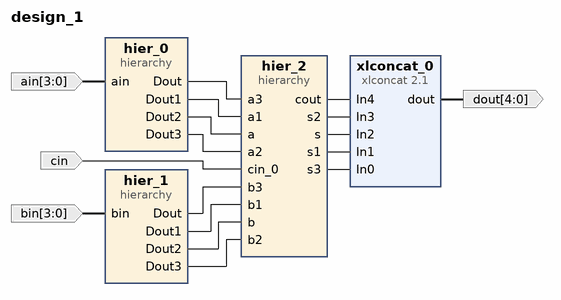
[diagram p0: block diagram of the top level]
# Vivado block design design_1, xc7a100tcsg324-1, Vivado 2024.2
create_bd_design design_1

create_bd_port -dir I -from 3 -to 0 ain
create_bd_port -dir I -from 3 -to 0 bin
create_bd_port -dir I cin
create_bd_port -dir O -from 4 -to 0 dout

create_bd_cell -type hier hier_0
create_bd_cell -type hier hier_1
create_bd_cell -type ip -vlnv xilinx.com:ip:xlconcat:2.1 xlconcat_0
set_property -dict {CONFIG.NUM_PORTS 5} [get_bd_cells xlconcat_0]
create_bd_cell -type hier hier_2

# ---- hierarchy /hier_0 ----
current_bd_instance /hier_0
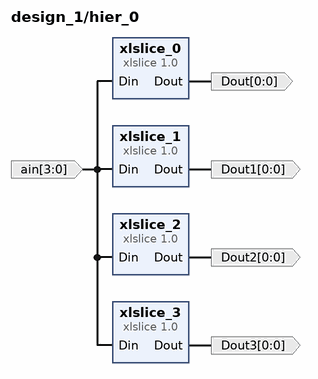
[diagram p1: block diagram inside /hier_0]
create_bd_pin -dir I -from 3 -to 0 ain
create_bd_pin -dir O -from 0 -to 0 Dout
create_bd_pin -dir O -from 0 -to 0 Dout1
create_bd_pin -dir O -from 0 -to 0 Dout2
create_bd_pin -dir O -from 0 -to 0 Dout3

create_bd_cell -type ip -vlnv xilinx.com:ip:xlslice:1.0 xlslice_0
set_property -dict {CONFIG.DIN_FROM 0 CONFIG.DIN_TO 0 CONFIG.DIN_WIDTH 4} [get_bd_cells xlslice_0]
create_bd_cell -type ip -vlnv xilinx.com:ip:xlslice:1.0 xlslice_1
set_property -dict {CONFIG.DIN_FROM 1 CONFIG.DIN_TO 1 CONFIG.DIN_WIDTH 4} [get_bd_cells xlslice_1]
create_bd_cell -type ip -vlnv xilinx.com:ip:xlslice:1.0 xlslice_2
set_property -dict {CONFIG.DIN_FROM 2 CONFIG.DIN_TO 2 CONFIG.DIN_WIDTH 4} [get_bd_cells xlslice_2]
create_bd_cell -type ip -vlnv xilinx.com:ip:xlslice:1.0 xlslice_3
set_property -dict {CONFIG.DIN_FROM 3 CONFIG.DIN_TO 3 CONFIG.DIN_WIDTH 4} [get_bd_cells xlslice_3]

# ---- hierarchy /hier_1 ----
current_bd_instance /hier_1
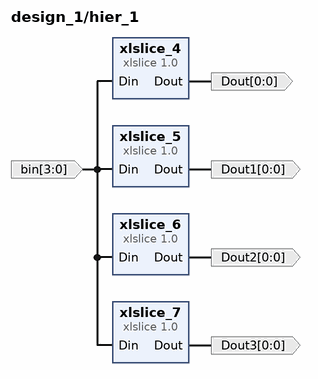
[diagram p2: block diagram inside /hier_1]
create_bd_pin -dir I -from 3 -to 0 bin
create_bd_pin -dir O -from 0 -to 0 Dout
create_bd_pin -dir O -from 0 -to 0 Dout1
create_bd_pin -dir O -from 0 -to 0 Dout2
create_bd_pin -dir O -from 0 -to 0 Dout3

create_bd_cell -type ip -vlnv xilinx.com:ip:xlslice:1.0 xlslice_4
set_property -dict {CONFIG.DIN_FROM 0 CONFIG.DIN_TO 0 CONFIG.DIN_WIDTH 4} [get_bd_cells xlslice_4]
create_bd_cell -type ip -vlnv xilinx.com:ip:xlslice:1.0 xlslice_5
set_property -dict {CONFIG.DIN_FROM 1 CONFIG.DIN_TO 1 CONFIG.DIN_WIDTH 4} [get_bd_cells xlslice_5]
create_bd_cell -type ip -vlnv xilinx.com:ip:xlslice:1.0 xlslice_6
set_property -dict {CONFIG.DIN_FROM 2 CONFIG.DIN_TO 2 CONFIG.DIN_WIDTH 4} [get_bd_cells xlslice_6]
create_bd_cell -type ip -vlnv xilinx.com:ip:xlslice:1.0 xlslice_7
set_property -dict {CONFIG.DIN_FROM 3 CONFIG.DIN_TO 3 CONFIG.DIN_WIDTH 4} [get_bd_cells xlslice_7]

# ---- hierarchy /hier_2 ----
current_bd_instance /hier_2
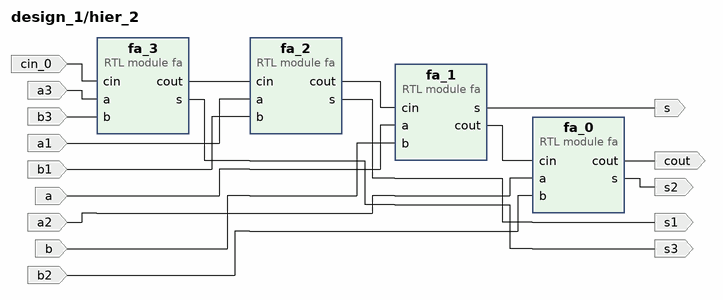
[diagram p3: block diagram inside /hier_2]
create_bd_pin -dir I a
create_bd_pin -dir I b
create_bd_pin -dir O s
create_bd_pin -dir I a1
create_bd_pin -dir I b1
create_bd_pin -dir O s1
create_bd_pin -dir I a2
create_bd_pin -dir I b2
create_bd_pin -dir O s2
create_bd_pin -dir O cout
create_bd_pin -dir I a3
create_bd_pin -dir I b3
create_bd_pin -dir I cin_0
create_bd_pin -dir O s3

create_bd_cell -type module -reference fa fa_1
create_bd_cell -type module -reference fa fa_2
create_bd_cell -type module -reference fa fa_0
create_bd_cell -type module -reference fa fa_3

# ---- connections ----

current_bd_instance /hier_0
connect_bd_net [get_bd_pins ain] [get_bd_pins xlslice_1/Din] [get_bd_pins xlslice_2/Din] [get_bd_pins xlslice_3/Din] [get_bd_pins xlslice_0/Din]
connect_bd_net [get_bd_pins xlslice_0/Dout] [get_bd_pins Dout]
connect_bd_net [get_bd_pins xlslice_1/Dout] [get_bd_pins Dout1]
connect_bd_net [get_bd_pins xlslice_2/Dout] [get_bd_pins Dout2]
connect_bd_net [get_bd_pins xlslice_3/Dout] [get_bd_pins Dout3]

current_bd_instance /hier_1
connect_bd_net [get_bd_pins bin] [get_bd_pins xlslice_5/Din] [get_bd_pins xlslice_6/Din] [get_bd_pins xlslice_7/Din] [get_bd_pins xlslice_4/Din]
connect_bd_net [get_bd_pins xlslice_4/Dout] [get_bd_pins Dout]
connect_bd_net [get_bd_pins xlslice_5/Dout] [get_bd_pins Dout1]
connect_bd_net [get_bd_pins xlslice_6/Dout] [get_bd_pins Dout2]
connect_bd_net [get_bd_pins xlslice_7/Dout] [get_bd_pins Dout3]

current_bd_instance /hier_2
connect_bd_net -net cin_0_1 [get_bd_pins cin_0] [get_bd_pins fa_3/cin]
connect_bd_net [get_bd_pins fa_0/cout] [get_bd_pins cout]
connect_bd_net [get_bd_pins fa_0/s] [get_bd_pins s2]
connect_bd_net [get_bd_pins fa_1/cout] [get_bd_pins fa_0/cin]
connect_bd_net [get_bd_pins fa_1/s] [get_bd_pins s]
connect_bd_net [get_bd_pins fa_2/cout] [get_bd_pins fa_1/cin]
connect_bd_net [get_bd_pins fa_2/s] [get_bd_pins s1]
connect_bd_net [get_bd_pins fa_3/cout] [get_bd_pins fa_2/cin]
connect_bd_net [get_bd_pins fa_3/s] [get_bd_pins s3]
connect_bd_net -net xlslice_0_Dout [get_bd_pins a3] [get_bd_pins fa_3/a]
connect_bd_net -net xlslice_1_Dout [get_bd_pins a1] [get_bd_pins fa_2/a]
connect_bd_net -net xlslice_2_Dout [get_bd_pins a] [get_bd_pins fa_1/a]
connect_bd_net -net xlslice_3_Dout [get_bd_pins a2] [get_bd_pins fa_0/a]
connect_bd_net -net xlslice_4_Dout [get_bd_pins b3] [get_bd_pins fa_3/b]
connect_bd_net -net xlslice_5_Dout [get_bd_pins b1] [get_bd_pins fa_2/b]
connect_bd_net -net xlslice_6_Dout [get_bd_pins b] [get_bd_pins fa_1/b]
connect_bd_net -net xlslice_7_Dout [get_bd_pins b2] [get_bd_pins fa_0/b]

current_bd_instance /
connect_bd_net [get_bd_ports ain] [get_bd_pins hier_0/ain]
connect_bd_net [get_bd_ports bin] [get_bd_pins hier_1/bin]
connect_bd_net -net cin_0_1 [get_bd_ports cin] [get_bd_pins hier_2/cin_0]
connect_bd_net -net fa_0_cout [get_bd_pins hier_2/cout] [get_bd_pins xlconcat_0/In4]
connect_bd_net -net fa_0_s [get_bd_pins hier_2/s2] [get_bd_pins xlconcat_0/In3]
connect_bd_net -net fa_1_s [get_bd_pins hier_2/s] [get_bd_pins xlconcat_0/In2]
connect_bd_net -net fa_2_s [get_bd_pins hier_2/s1] [get_bd_pins xlconcat_0/In1]
connect_bd_net -net fa_3_s [get_bd_pins hier_2/s3] [get_bd_pins xlconcat_0/In0]
connect_bd_net [get_bd_pins xlconcat_0/dout] [get_bd_ports dout]
connect_bd_net -net xlslice_0_Dout [get_bd_pins hier_0/Dout] [get_bd_pins hier_2/a3]
connect_bd_net -net xlslice_1_Dout [get_bd_pins hier_0/Dout1] [get_bd_pins hier_2/a1]
connect_bd_net -net xlslice_2_Dout [get_bd_pins hier_0/Dout2] [get_bd_pins hier_2/a]
connect_bd_net -net xlslice_3_Dout [get_bd_pins hier_0/Dout3] [get_bd_pins hier_2/a2]
connect_bd_net -net xlslice_4_Dout [get_bd_pins hier_1/Dout] [get_bd_pins hier_2/b3]
connect_bd_net -net xlslice_5_Dout [get_bd_pins hier_1/Dout1] [get_bd_pins hier_2/b1]
connect_bd_net -net xlslice_6_Dout [get_bd_pins hier_1/Dout2] [get_bd_pins hier_2/b]
connect_bd_net -net xlslice_7_Dout [get_bd_pins hier_1/Dout3] [get_bd_pins hier_2/b2]

validate_bd_design
save_bd_design
